# EAGLE schematic view-board-mid (EAGLE 7.6.0)
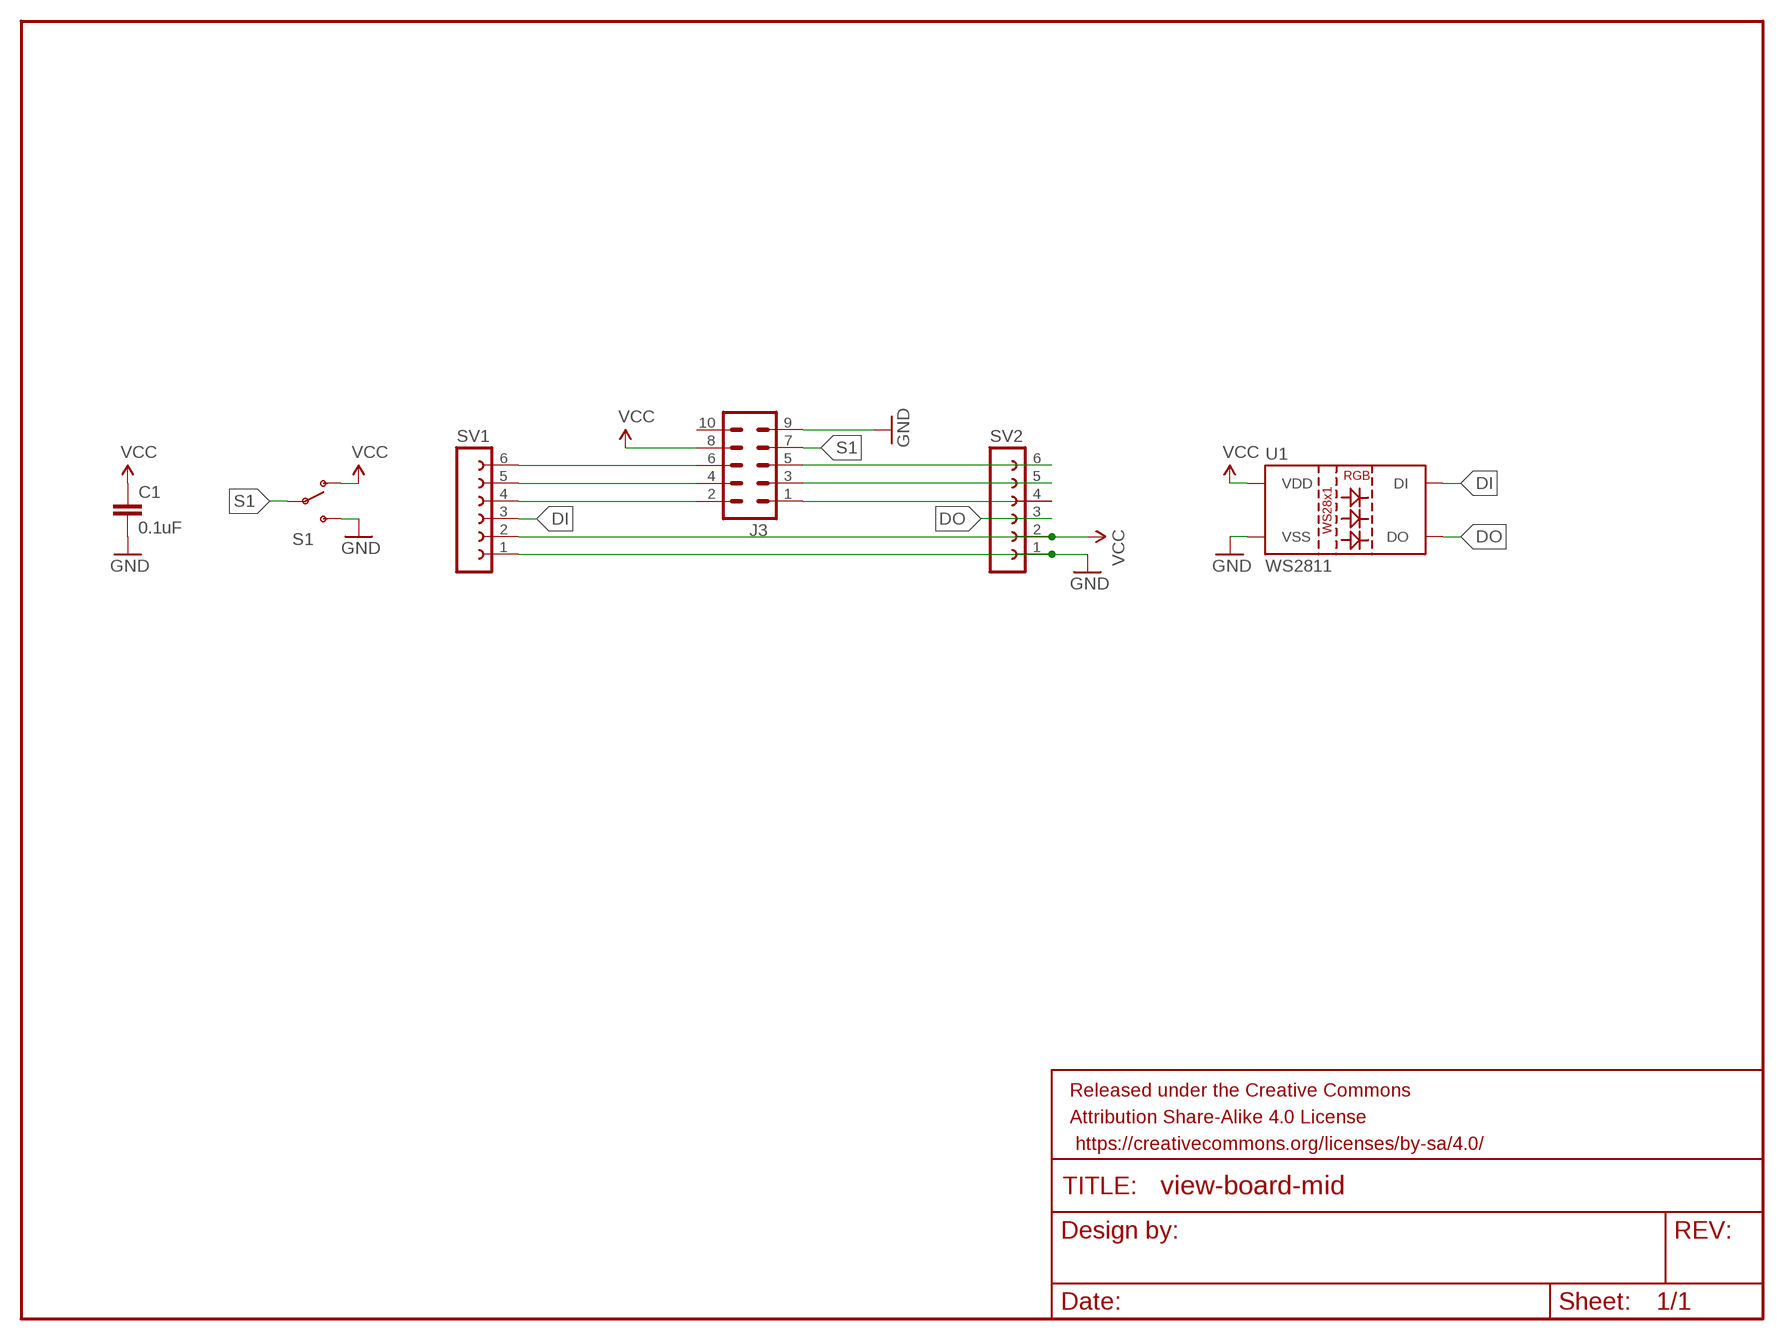
[diagram p0: schematic, sheet 1]

## Parts
C1  0.1uF  CAP0805  [0805]
FRAME1  FRAME-LETTER  [CREATIVE_COMMONS]
J3  M05X2SHD  [2X5-SHROUDED]
S1  SWITCH-SPDTPTH  [SWITCH-SPDT]
SV1  FE06-1  [FE06]
SV2  FE06-1  [FE06]
U1  WS2811  LED-TRICOLOR-5050-ICWS2811  [LED-TRICOLOR-5050-IC]

## Nets
DI: SV1.3 U1.2(DI)
DO: SV2.3 U1.1(DO)
GND: C1.2 J3.9 S1.3(S) SV1.1 SV2.1 U1.6(VSS)
N$1: J3.2 SV1.4
N$2: J3.1 SV2.4
N$3: J3.3 SV2.5
N$4: J3.4 SV1.5
N$5: J3.6 SV1.6
N$6: J3.5 SV2.6
S1: J3.7 S1.2(P)
VCC: C1.1 J3.8 S1.1(O) SV1.2 SV2.2 U1.3(VDD) U1.5(VDD)
Unconnected: J3.10

## Library data of the parts
C1 = SparkFun-Capacitors:CAP: Capacitor Standard 0603 ceramic capacitor, and 0.1" leaded capacitor.
FRAME1 = SparkFun-Aesthetics:FRAME-LETTER: Schematic Frame Standard 8.5x11 US Letter frame
J3 = SparkFun-Connectors:M05X2: Header 5x2 Standard 10-pin dual row 0.1" header. Commonly used with AVR-ISP. Use with Spark Fun Electronics SKU: PRT-00778
S1 = SparkFun-Electromechanical:SWITCH-SPDT: SPDT Switch Simple slide switch, Spark Fun Electronics SKU : COM-00102 DPDT SMT slide switch, AYZ0202, SWCH-08179; PROD_ID: SWCH-08261
SV1 SV2 = con-lsta:FE06-1: FEMALE HEADER; OC_FARNELL: unknown; OC_NEWARK: unknown
U1 = SparkFun-LED:LED-TRICOLOR-5050-IC: WS2812 RGB LED w/ WS2811 driver 5x5mm SMD LED with built-in controller IC. DIO-11598; PROD_ID: DIO-11598